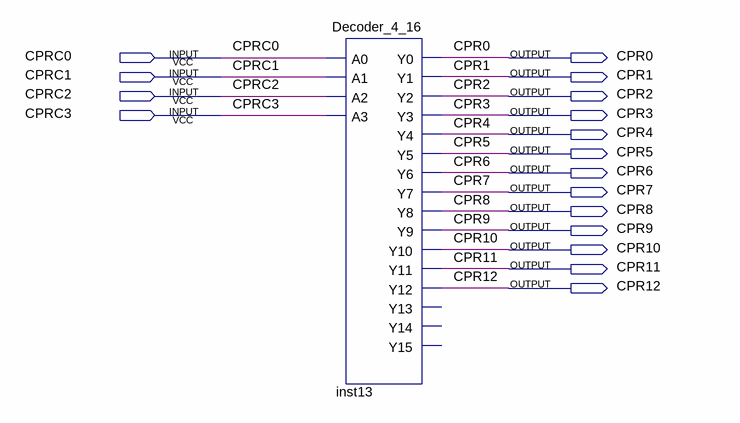
[diagram p0: schematic sheet]
// Quartus schematic CPR_Test.bdf as structural Verilog: 1 symbols, 17 pins
module CPR_Test (
  input  CPRC0,
  input  CPRC1,
  input  CPRC2,
  input  CPRC3,
  output CPR0,
  output CPR1,
  output CPR2,
  output CPR3,
  output CPR4,
  output CPR5,
  output CPR6,
  output CPR7,
  output CPR8,
  output CPR9,
  output CPR10,
  output CPR11,
  output CPR12
);

  Decoder_4_16 inst13 (
    .A0(CPRC0), .A1(CPRC1), .A2(CPRC2), .A3(CPRC3), .Y0(CPR0), .Y1(CPR1), .Y2(CPR2), .Y3(CPR3), .Y4(CPR4),
    .Y5(CPR5), .Y6(CPR6), .Y7(CPR7), .Y8(CPR8), .Y9(CPR9), .Y10(CPR10), .Y11(CPR11), .Y12(CPR12));  // open: Y13, Y14, Y15
endmodule
